# Altium project top.PrjPcb
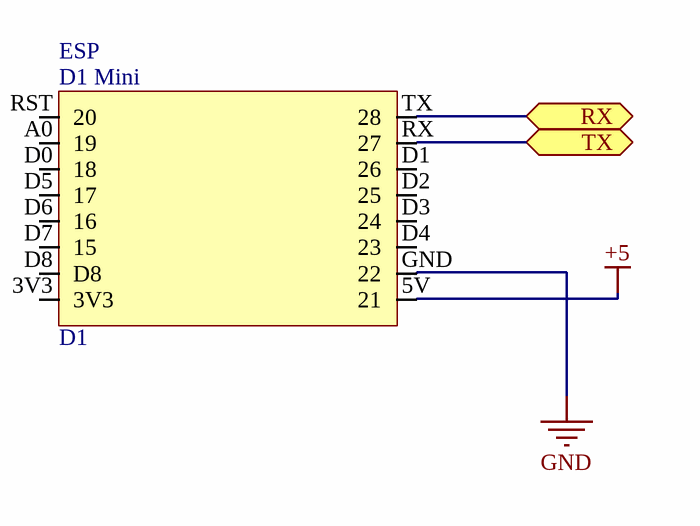
[diagram p0: ESP8266_Sheet.SchDoc]
4 sheets, 20 parts. Net scope: flat (ports and power ports of the same name join across sheets).
Board files: main.PcbDoc, test_board.PcbDoc
Sheets:
  ESP8266_Sheet.SchDoc
  Motors_Sheet.SchDoc
  Programmer_Sheet.SchDoc
  connection_Sheet.SchDoc

## Sheet ESP8266_Sheet.SchDoc
size A

### Parts
ESP  D1  [WEMOS_D1_MINI]

### Ports
RX (bidir), TX (bidir)

### Nets
+5: ESP.5V(21)
GND: ESP.GND(22)
NetESP_RX: ESP.RX(27) ; port TX
NetESP_TX: ESP.TX(28) ; port RX

Not connected (* = marked no-connect by the designer): ESP 3V3 A0(19) D0(18) D1(26) D2(25) D3(24) D4(23) D5(17) D6(16) D7(15) D8 RST(20)

### Notes on the sheet
- (in symbol WEMOS_D1_MINI) D1 Mini

### Library data of the parts
ESP = WEMOS_D1_MINI

## Sheet Motors_Sheet.SchDoc
size A
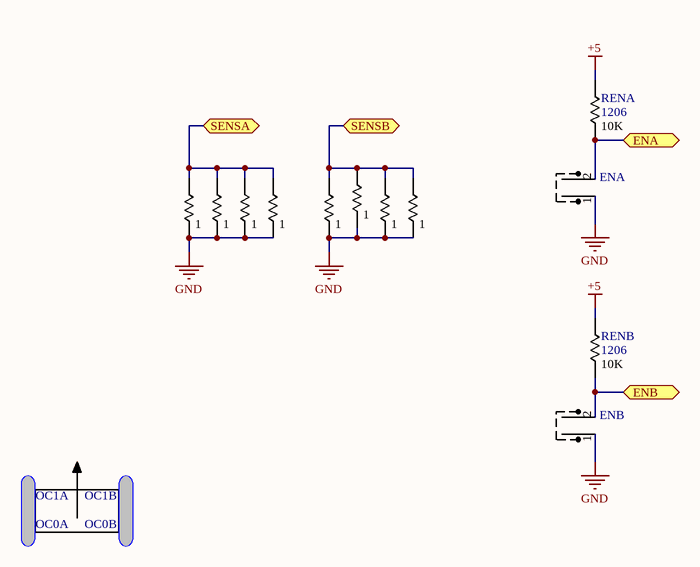
[diagram p1: Motors_Sheet.SchDoc]

### Parts
ENA  jumper  [JUMPER2]  (value not drawn)
ENB  jumper  [JUMPER2]  (value not drawn)
RENA  1206  value 10K  [1206]
RENB  1206  value 10K  [1206]
RS1  value 1  [1206]  (hidden comment: 1206)
RS2  value 1  [1206]  (hidden comment: 1206)
RS3  value 1  [1206]  (hidden comment: 1206)
RS4  value 1  [1206]  (hidden comment: 1206)
RS5  value 1  [1206]  (hidden comment: 1206)
RS6  value 1  [1206]  (hidden comment: 1206)
RS7  value 1  [1206]  (hidden comment: 1206)
RS8  value 1  [1206]  (hidden comment: 1206)

### Ports
ENA (bidir), ENB (bidir), SENSA (bidir), SENSB (bidir)

### Nets
+5: RENA.2 RENB.2
GND: ENA.1 ENB.1 RS1.1 RS2.1 RS3.1 RS4.1 RS5.1 RS6.1 RS7.1 RS8.1
NetENA_2: ENA.2 RENA.1 ; port ENA
NetENB_2: ENB.2 RENB.1 ; port ENB
Netj7_1: RS1.2 RS2.2 RS3.2 RS4.2 ; port SENSA
Netj7_2: RS5.2 RS6.2 RS7.2 RS8.2 ; port SENSB

### Notes on the sheet
- OC1A
- OC0A
- OC1B
- OC0B

### Library data of the parts
ENA ENB = Jumper_2

## Sheet Programmer_Sheet.SchDoc
size A
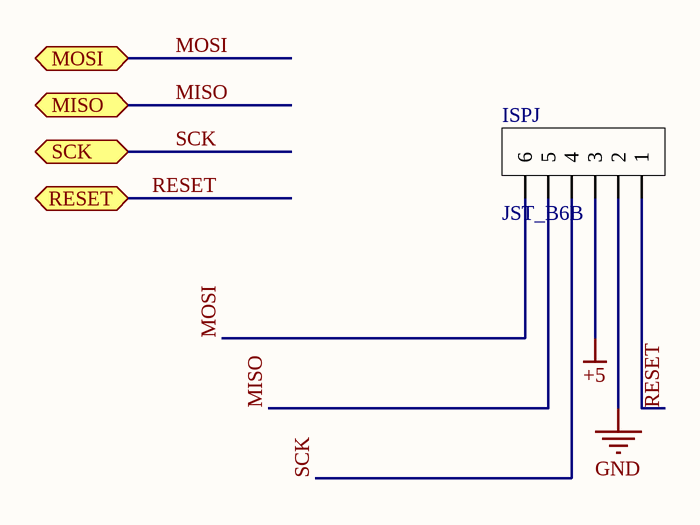
[diagram p2: Programmer_Sheet.SchDoc]

### Parts
ISPJ  JST_B6B  [JST_B6B]

### Ports
MISO (bidir), MOSI (bidir), RESET (bidir), SCK (bidir)

### Nets
+5: ISPJ.3
GND: ISPJ.2
MISO: ISPJ.5 ; port MISO
MOSI: ISPJ.6 ; port MOSI
RESET: ISPJ.1 ; port RESET
SCK: ISPJ.4 ; port SCK

## Sheet connection_Sheet.SchDoc
size A
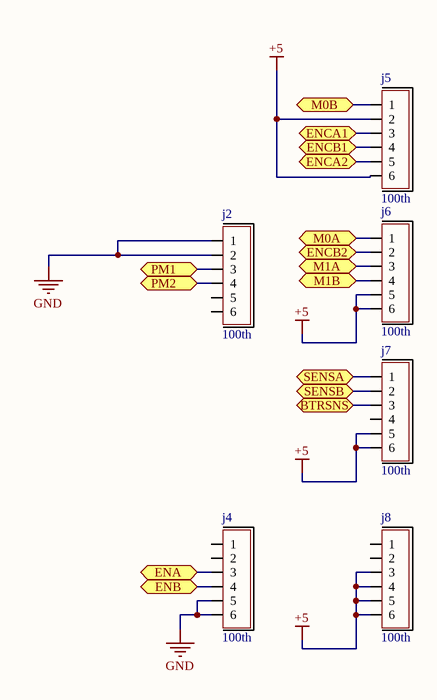
[diagram p3: connection_Sheet.SchDoc]

### Parts
j2  100th  [pin6header]
j4  100th  [pin6header]
j5  100th  [pin6header]
j6  100th  [pin6header]
j7  100th  [pin6header]
j8  100th  [pin6header]

### Ports
BTRSNS (bidir), ENA (bidir), ENB (bidir), ENCA1 (bidir), ENCA2 (bidir), ENCB1 (bidir), ENCB2 (bidir), M0A (bidir), M0B (bidir), M1A (bidir), M1B (bidir), PM1 (bidir), PM2 (bidir), SENSA (bidir), SENSB (bidir)

### Nets
+5: j5.2 j5.6 j6.5 j6.6 j7.5 j7.6 j8.3 j8.4 j8.5 j8.6
GND: j2.1 j2.2 j4.5 j4.6
NetENA_2: j4.3 ; port ENA
NetENB_2: j4.4 ; port ENB
Netj2_3: j2.3 ; port PM1
Netj2_4: j2.4 ; port PM2
Netj5_1: j5.1 ; port M0B
Netj5_3: j5.3 ; port ENCA1
Netj5_4: j5.4 ; port ENCB1
Netj5_5: j5.5 ; port ENCA2
Netj6_1: j6.1 ; port M0A
Netj6_2: j6.2 ; port ENCB2
Netj6_3: j6.3 ; port M1A
Netj6_4: j6.4 ; port M1B
Netj7_1: j7.1 ; port SENSA
Netj7_2: j7.2 ; port SENSB
Netj7_3: j7.3 ; port BTRSNS

Not connected (* = marked no-connect by the designer): j2 5 6; j4 1 2; j7 4; j8 1 2

### Library data of the parts
j2 j4-j8 = pin6header: System: Connector

## Nets that join several sheets
+5: ESP8266_Sheet (ESP.5V), Motors_Sheet (RENA.2 RENB.2), Programmer_Sheet (ISPJ.3), connection_Sheet (10 pins)
GND: ESP8266_Sheet (ESP.GND), Motors_Sheet (10 pins), Programmer_Sheet (ISPJ.2), connection_Sheet (j2.1 j2.2 j4.5 j4.6)
NetENA_2: Motors_Sheet (ENA.2 RENA.1), connection_Sheet (j4.3)
NetENB_2: Motors_Sheet (ENB.2 RENB.1), connection_Sheet (j4.4)
Netj7_1: Motors_Sheet (RS1.2 RS2.2 RS3.2 RS4.2), connection_Sheet (j7.1)
Netj7_2: Motors_Sheet (RS5.2 RS6.2 RS7.2 RS8.2), connection_Sheet (j7.2)